# Altium project WienOscilator.PrjPcb
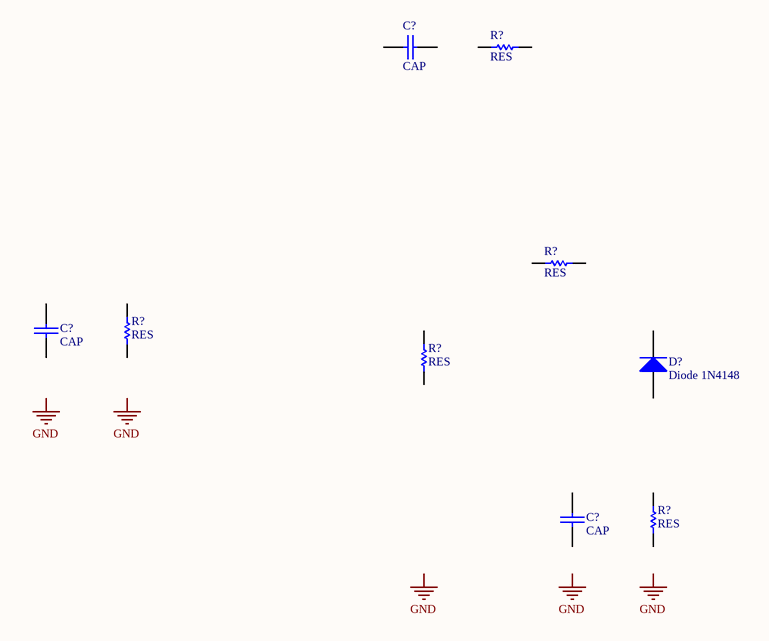
[diagram p0: WienOscilator.SchDoc]
1 sheet, 9 parts. Net scope: global (net labels, ports and power ports of the same name join across sheets).
Board file: WienOsilator.PcbDoc

## Sheet WienOscilator.SchDoc
size A4

### Parts
(Parts that share a designator on the sheet are numbered #1, #2 ... from top to bottom, then left to right.)
C1  CAP  [CAP200]
C2  CAP  [CAP200]
C?  CAP  [CAP200]
D?  Diode 1N4148  [DO-35]
R3  RES  [0805]
R5  RES  [0805]
R7  RES  [0805]
R?#1  RES  [0805]
R?#2  RES  [0805]

### Nets

Not connected (* = marked no-connect by the designer): C1 1 2; C2 1 2; C? 1 2; D? 1(A) 2(K); R3 1 2; R5 1 2; R7 1 2; R?#1 1 2; R?#2 1 2

### Notes on the sheet
- Labels drawn without touching a wire or pin: GND

### Library data of the parts
D? = Diode 1N4148: High Conductance Fast Diode; Published: 8-Jun-2000; LatestRevisionDate: 17-Jul-2002; LatestRevisionNote: Re-released for DXP Platform.; DatasheetVersion: 1997; PackageReference: DO-35; Publisher: Altium Limited; PackageDescription: Diode, Axial; Body 3.8 x 1.9 mm (LxDia. max), Lead Dia. 0.53 mm (max); Code_JEDEC: DO-204-AH; ComponentLink1Description: Manufacturer Link; ComponentLink1URL: http://www.fairchildsemi.com/; ComponentLink2Description: Datasheet; ComponentLink2URL: http://www.fairchildsemi.com/ds/1N%2F1N4148.pdf